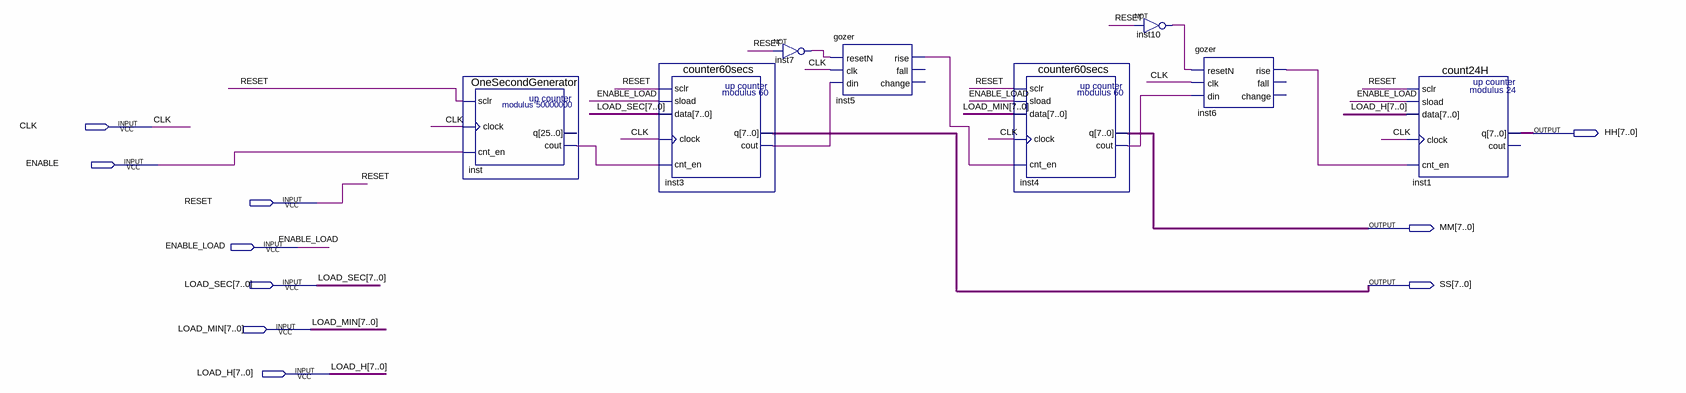
[diagram p0: schematic sheet]
// Quartus schematic Basic_clock.bdf as structural Verilog: 8 symbols, 10 pins
module Basic_clock (
  input  CLK,
  input  ENABLE,
  input  RESET,
  input  ENABLE_LOAD,
  input  [7:0] LOAD_SEC,
  input  [7:0] LOAD_MIN,
  input  [7:0] LOAD_H,
  output [7:0] HH,
  output [7:0] MM,
  output [7:0] SS
);

  wire inst3_cout, inst4_cout, inst5_rise, inst6_rise, inst7_out, inst10_out, inst_cout;

  OneSecondGenerator inst (.sclr(RESET), .clock(CLK), .cnt_en(ENABLE), .cout(inst_cout));  // open: q
  counter60secs inst3 (
    .sclr(RESET), .sload(ENABLE_LOAD), .data(LOAD_SEC), .clock(CLK), .cnt_en(inst_cout), .cout(inst3_cout),
    .q(SS));
  not inst7 (inst7_out, RESET);
  gozer inst5 (.resetN(inst7_out), .clk(CLK), .din(inst3_cout), .rise(inst5_rise));  // open: fall, change
  counter60secs inst4 (
    .sclr(RESET), .sload(ENABLE_LOAD), .data(LOAD_MIN), .clock(CLK), .cnt_en(inst5_rise), .cout(inst4_cout),
    .q(MM));
  not inst10 (inst10_out, RESET);
  gozer inst6 (.resetN(inst10_out), .clk(CLK), .din(inst4_cout), .rise(inst6_rise));  // open: fall, change
  count24H inst1 (
    .sclr(RESET), .sload(ENABLE_LOAD), .data(LOAD_H), .clock(CLK), .cnt_en(inst6_rise), .q(HH));  // open: cout
endmodule
